# EAGLE design blip (EAGLE 9.6.2)
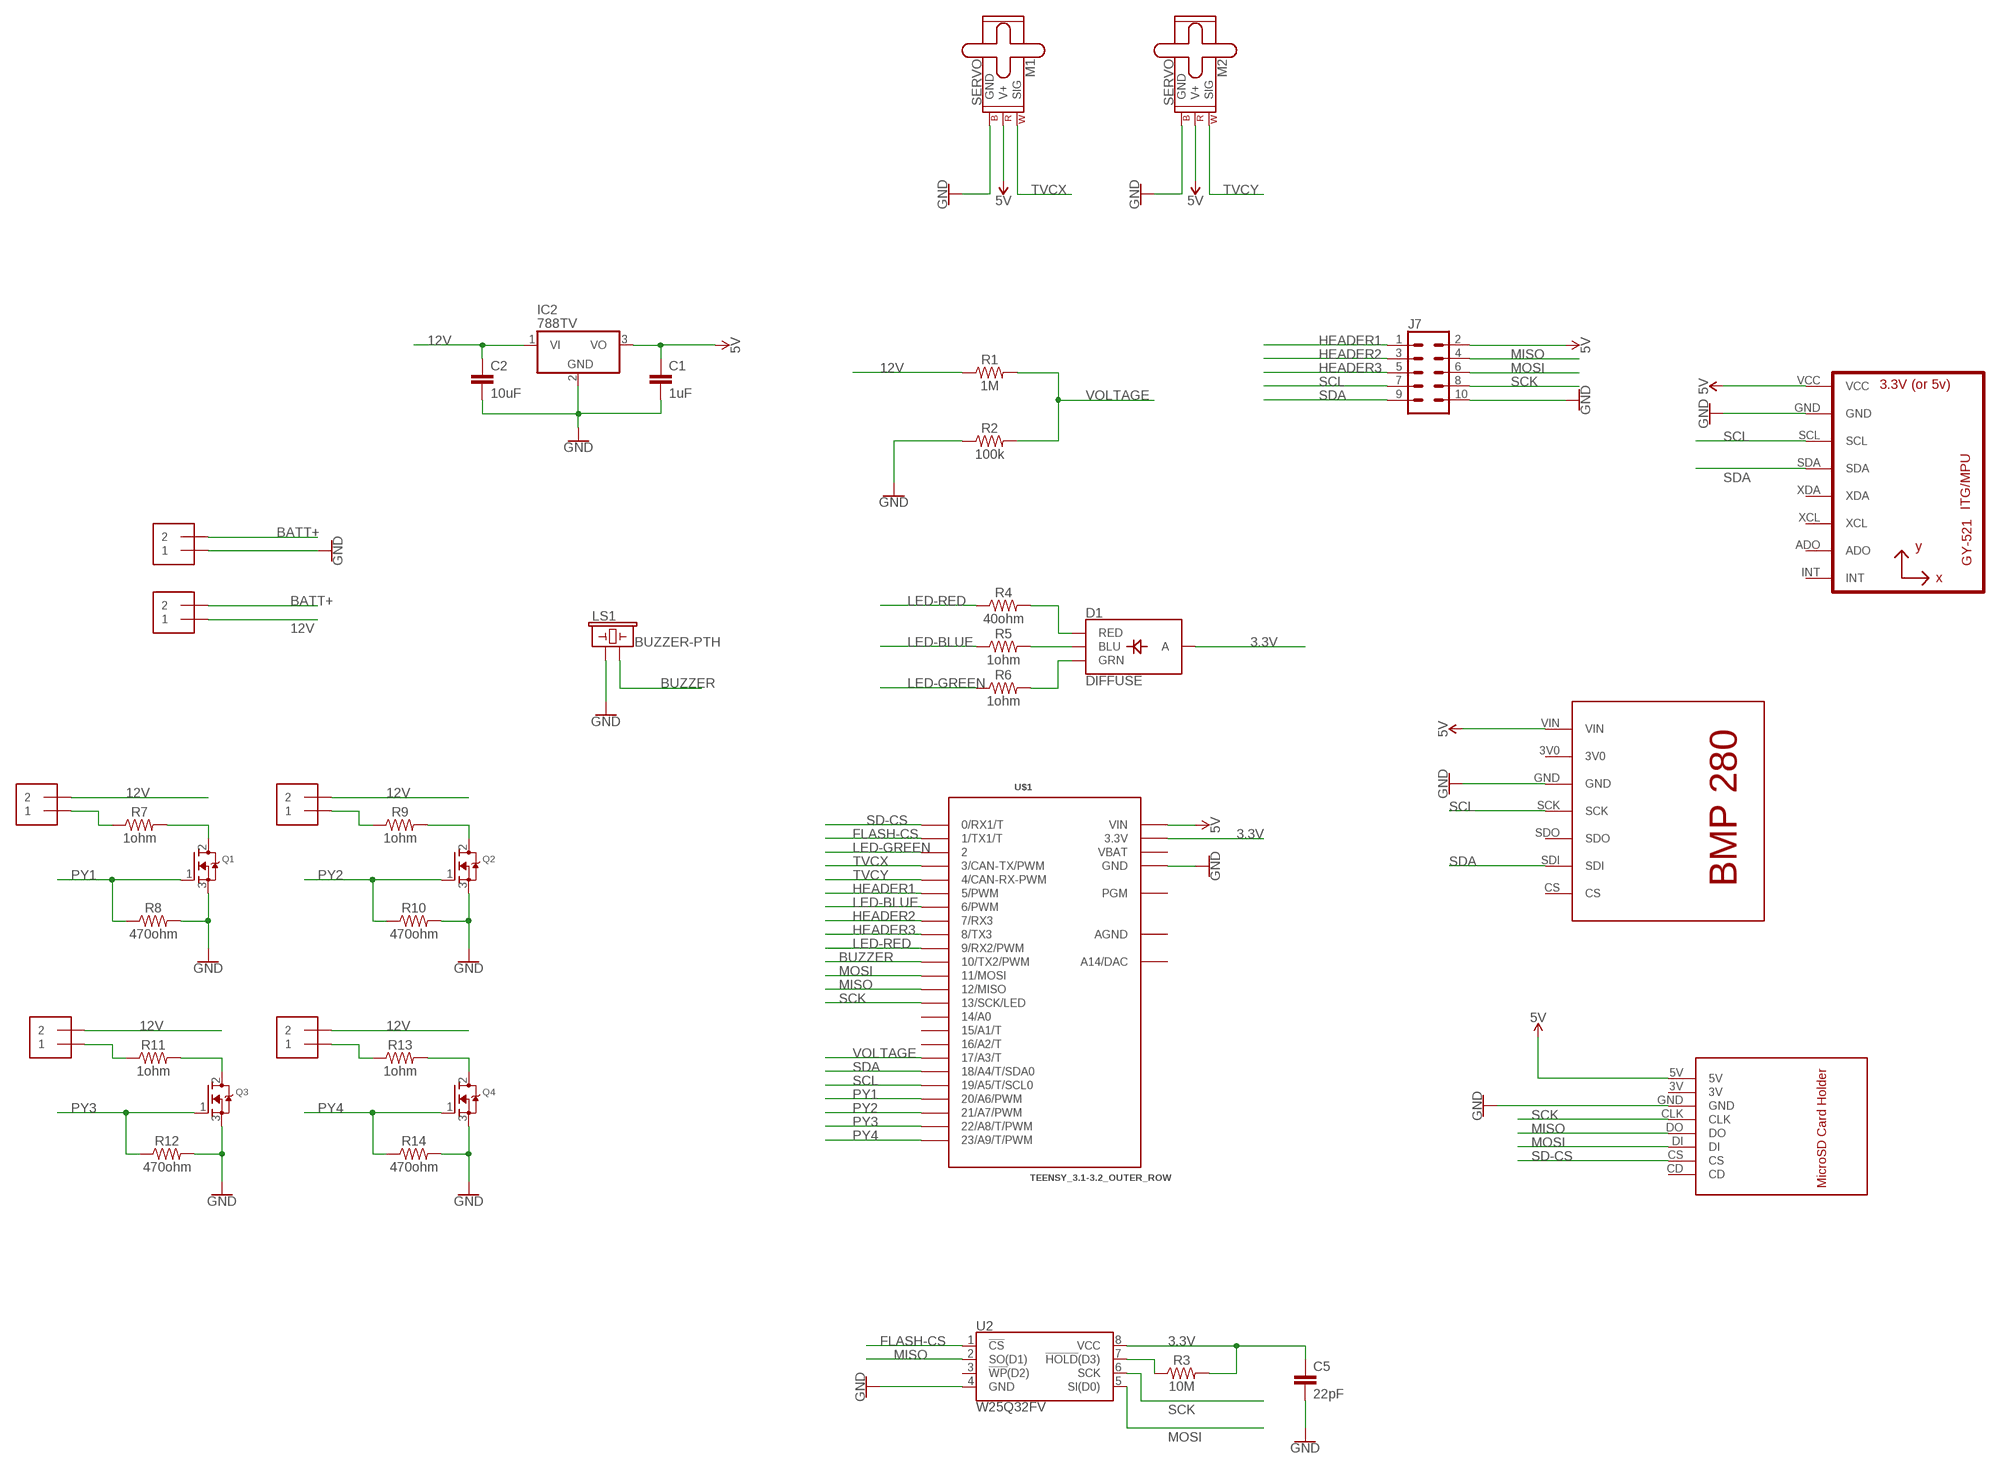
[diagram p0: schematic, sheet 1]

## Parts
C1  1uF  22PF-PTH-2.54MM-200V-5%  [CAP-PTH-2.54]
C2  10uF  22PF-PTH-2.54MM-200V-5%  [CAP-PTH-2.54]
C5  22pF  22PF-PTH-2.54MM-200V-5%  [CAP-PTH-2.54]
D1  DIFFUSE  LED-RGB-CADIFFUSE  [LED-RGB-THRU]
IC2  788TV  [TO220V]
J1  1X2-3.5MM  [1X2-3.5MM]
J2  1X2-3.5MM  [1X2-3.5MM]
J3  1X2-3.5MM  [1X2-3.5MM]
J4  1X2-3.5MM  [1X2-3.5MM]
J5  1X2-3.5MM  [1X2-3.5MM]
J6  1X2-3.5MM  [1X2-3.5MM]
J7  CONN_05X2NO_SILK  [2X5_NOSILK]
LS1  BUZZER-PTH  [BUZZER-12MM]
M1  SERVO  [1X03]
M2  SERVO  [1X03]
Q1  MOSFET-NGDS_TO220V  [TO220V]
Q2  MOSFET-NGDS_TO220V  [TO220V]
Q3  MOSFET-NGDS_TO220V  [TO220V]
Q4  MOSFET-NGDS_TO220V  [TO220V]
R1  1M  10MOHM-HORIZ-1/4W-5%  [AXIAL-0.3]
R2  100k  10MOHM-HORIZ-1/4W-5%  [AXIAL-0.3]
R3  10M  10MOHM-HORIZ-1/4W-5%  [AXIAL-0.3]
R4  40ohm  10MOHM-HORIZ-1/4W-5%  [AXIAL-0.3]
R5  1ohm  10MOHM-HORIZ-1/4W-5%  [AXIAL-0.3]
R6  1ohm  10MOHM-HORIZ-1/4W-5%  [AXIAL-0.3]
R7  1ohm  10MOHM-HORIZ-1/4W-5%  [AXIAL-0.3]
R8  470ohm  10MOHM-HORIZ-1/4W-5%  [AXIAL-0.3]
R9  1ohm  10MOHM-HORIZ-1/4W-5%  [AXIAL-0.3]
R10  470ohm  10MOHM-HORIZ-1/4W-5%  [AXIAL-0.3]
R11  1ohm  10MOHM-HORIZ-1/4W-5%  [AXIAL-0.3]
R12  470ohm  10MOHM-HORIZ-1/4W-5%  [AXIAL-0.3]
R13  1ohm  10MOHM-HORIZ-1/4W-5%  [AXIAL-0.3]
R14  470ohm  10MOHM-HORIZ-1/4W-5%  [AXIAL-0.3]
U1  GY-521MPU6050  [GY-521]
U2  W25Q32FV  W25Q32FVSS  [SOIC-8]
U$1  TEENSY_3.1-3.2_OUTER_ROW  [TEENSY_3.0-3.2&LC_OUTER_ROW]
U$2  BMP280  [BMP280]
U$3  SDCARD  [SDCARD]

## Nets
3.3V: C5.1 D1.2(A) R3.P$2 U2.8(VCC) U$1.3.3V U$1.3.3V1(3.3V)
5V: C1.1 IC2.3(VO) J7.2 M1.2(V+) M2.2(V+) U1.VCC U$1.VIN U$2.VIN U$3.5V
12V: C2.1 IC2.1(VI) J2.1 J3.2 J4.2 J5.2 J6.2 R1.P$1
BATT+: J1.2 J2.2
BUZZER: LS1.- U$1.10(10/TX2/PWM)
FLASH-CS: U2.1(!CS!) U$1.1(1/TX1/T)
GND: C1.2 C2.2 C5.2 IC2.2(GND) J1.1 J7.10 LS1.+ M1.3(GND) M2.3(GND) Q1.3(S) Q2.3(S) Q3.3(S) Q4.3(S) R2.P$1 R8.P$2 R10.P$2 R12.P$2 R14.P$2 U1.GND U2.4(GND) U$1.GND U$1.GND1(GND) U$2.GND U$3.GND
HEADER1: J7.1 U$1.5(5/PWM)
HEADER2: J7.3 U$1.7(7/RX3)
HEADER3: J7.5 U$1.8(8/TX3)
LED-BLUE: R5.P$1 U$1.6(6/PWM)
LED-GREEN: R6.P$1 U$1.2
LED-RED: R4.P$1 U$1.9(9/RX2/PWM)
MISO: J7.4 U2.2(SO(D1)) U$1.12(12/MISO) U$3.DO
MOSI: J7.6 U2.5(SI(D0)) U$1.11(11/MOSI) U$3.DI
N$1: R3.P$1 U2.7(!HOLD!(D3))
N$2: D1.4(BLU) R5.P$2
N$3: D1.3(GRN) R6.P$2
N$4: D1.1(RED) R4.P$2
N$5: J3.1 R7.P$1
N$6: Q1.2(D) R7.P$2
N$8: J4.1 R9.P$1
N$9: Q2.2(D) R9.P$2
N$11: J5.1 R11.P$1
N$12: Q3.2(D) R11.P$2
N$14: J6.1 R13.P$1
N$15: Q4.2(D) R13.P$2
PY1: Q1.1(G) R8.P$1 U$1.20/A6(20/A6/PWM)
PY2: Q2.1(G) R10.P$1 U$1.21/A7(21/A7/PWM)
PY3: Q3.1(G) R12.P$1 U$1.22/A8(22/A8/T/PWM)
PY4: Q4.1(G) R14.P$1 U$1.23/A9(23/A9/T/PWM)
SCK: J7.8 U2.6(SCK) U$1.13(13/SCK/LED) U$3.CLK
SCL: J7.7 U1.SCL U$1.19/A5(19/A5/T/SCL0) U$2.SCK
SD-CS: U$1.0(0/RX1/T) U$3.CS
SDA: J7.9 U1.SDA U$1.18/A4(18/A4/T/SDA0) U$2.SDI
TVCX: M1.1(SIG) U$1.3(3/CAN-TX/PWM)
TVCY: M2.1(SIG) U$1.4(4/CAN-RX-PWM)
VOLTAGE: R1.P$2 R2.P$2 U$1.17/A3(17/A3/T)
Unconnected: U1.ADO U1.INT U1.XCL U1.XDA U2.3(!WP!(D2)) U$1.14/A0 U$1.15/A1(15/A1/T) U$1.16/A2(16/A2/T) U$1.PGM U$1.RESET/DAC(A14/DAC) U$2.3V0 U$2.CS U$2.SDO U$3.3V U$3.CD

## Power pins joined to a net without a drawn wire
AGND: U$1.AGND
VBAT: U$1.VBAT

## Library data of the parts
C1 C2 = SparkFun-Capacitors:22PF: 22pF ceramic capacitors A capacitor is a passive two-terminal electrical component used to store electrical energy temporarily in an electric field.; PROD_ID: CAP-09128; VALUE: 22pF
C5 = SparkFun-Capacitors:22PF: 22pF ceramic capacitors A capacitor is a passive two-terminal electrical component used to store electrical energy temporarily in an electric field.; PROD_ID: CAP-09128
D1 = SparkFun-LED:LED-RGB-CA: LED-RGB Diffused Common Anode Packages: LED RGB-THRU P-LCC-4-3 LED-TRICOLOR-SMD SparkFun Products: RGB Diffused Common Anode- Diffuse <[https://www.sparkfun.com/products/10821]> RGB Diffused Common Anode - Clear <[https://www.sparkfun.com/products/10820]> Qduino Mini <[https://www.sparkfun.com/products/13614]> Triple Output LED RGB - SMD <https://www.sparkfun.com/products/7844>; PROD_ID: DIO-10632
IC2 = linear:78*: Positive VOLTAGE REGULATOR Source: http://cache.national.com/ds/LM/LM78L05.pdf http://www.fairchildsemi.com/ds/LM/LM7805.pdf
J1-J6 = adafruit:1X2: 3.5mm Terminal block http://www.ladyada.net/library/pcb/eaglelibrary.html
J7 = SparkFun-Connectors:CONN_05X2: Multi connection point. Often used as Generic Header-pin footprint for 0.1 inch spaced/style header connections For AVR SPI programming port, see special device with nice symbol: "AVR_SPI_PROG_5x2.dev" You can populate with any combo of single row headers, but if you'd like an exact match, check these: 2x5 AVR ICSP Male Header <https://www.sparkfun.com/products/778> (PRT-00778) 2x5 Pin Shrouded Header <https://www.sparkfun.com/products/8506> (PRT-08506) On any of the 0.1 inch spaced packages, you can populate with these: Break Away Headers - Straight <https://www.sparkfun.com/products/116> (PRT-00116) Break Away Male Headers - Right Angle <https://www.sparkfun.com/products/553> (PRT-00553) Female Headers <https://www.sparkfun.com/products/115> (PRT-00115) Break Away Headers - Machine Pin <https://www.sparkfun.com/products/117> (PRT-00117) Break Away Female Headers - Swiss Machine Pin <https://www.sparkfun.com/products/743> (PRT-00743) Special note: the shrouded connector mates well with our 5x2 ribbon cables: 2x5 Pin IDC Ribbon Cable <https://www.sparkfun.com/products/8535> (PRT-08535)
LS1 = SparkFun-Electromechanical:BUZZER: Buzzer Small round buzzers that operate around the audible 2kHz range. You can use these as speakers to create simple music or user interfaces. Variant Overview: PTH - Mini Speaker - PC Mount 12mm 2.048kHz <https://www.sparkfun.com/products/7950> PTH_KIT - Mini Speaker - PC Mount 12mm 2.048kHz <https://www.sparkfun.com/products/7950> KIT simplifies soldering by adding stop mask to one side of the pads. PTH_NO_SILK - Mini Speaker - PC Mount 12mm 2.048kHz <https://www.sparkfun.com/products/7950> No silkscreen indicator of buzzer outline. PTH_KIT_NO_SILK - Mini Speaker - PC Mount 12mm 2.048kHz <https://www.sparkfun.com/products/7950> KIT package w/o silkscreen SMD - Buzzer Audio Magnetic (CCV-084B16) SMD buzzer used on, e.g. the LilyPad Buzzer <https://www.sparkfun.com/products/8463> and RFID USB Reader <https://www.sparkfun.com/products/9963>. SMD_KIT - Buzzer Audio Magnetic (CCV-084B16) SMD Buzzer with elongated pins to make soldering easier. Used on the SparkFun Simon Says - Surface Mount Soldering Kit <https://www.sparkfun.com/products/10935>. SMD-SQUARE - Buzzer Audio Magnetic (COMP-15701) SMT square buzzer with one chamfered corner.; PROD_ID: COMP-08253; SF_SKU: COM-07950
M1 M2 = SparkFun-Electromechanical:SERVO: Servo Motor 3-pin connector for a standard servo motor (voltage supply, ground, and control signal.) SparkFun Products Servo - Generic (Sub-Micro Size) <https://www.sparkfun.com/products/9065> (ROB-09065) Servo - Generic High Torque Continuous Rotation (Standard Size) <https://www.sparkfun.com/products/9347> (ROB-09347) Servo - Generic High Torque (Standard Size) <https://www.sparkfun.com/products/11965> (ROB-11965)
Q1-Q4 = adafruit:MOSFET-N: N-Channel Mosfet 2N7002E - 60V 260mA SOT23 [Digikey: 2N7002ET1GOSTR-ND] - REEL BSH103 - 30V 850mA SOT23 [Digikey: 568-5013-1-ND]
R1 R2 R4-R14 = SparkFun-Resistors:10MOHM: RES-09327; PROD_ID: RES-09327; VALUE: 10M
R3 = SparkFun-Resistors:10MOHM: RES-09327; PROD_ID: RES-09327
U1 = gy-521:GY-521
U2 = SparkFun-IC-Memory:W25Q32FV: W25Q32FV 32Mb (4MB) Serial Flash Memory The W25Q32FV support the standard Serial Peripheral Interface (SPI), Dual/Quad I/O SPI as well as 2-clocks instruction cycle Quad Peripheral Interface (QPI). 104MHz, SPI, 8-SOIC-EIAJ Datasheet <http://www.winbond.com/resource-files/w25q32fv%20revh%20091613.pdf> SparkFun Products SparkFun Blynk Board - ESP8266 <https://www.sparkfun.com/products/13794> (WRL-13794); PROD_ID: IC-13229
U$1 = Teensy_3_and_LC_Series_Boards_v1.4:TEENSY_3.1-3.2_OUTER_ROW: Footprint for Teensy 3.1 or 3.2 board using all pin connections on the outer perimeter
U$2 = BMP280:BMP280
U$3 = MicroSD-card breakout board:SDCARD

## Board
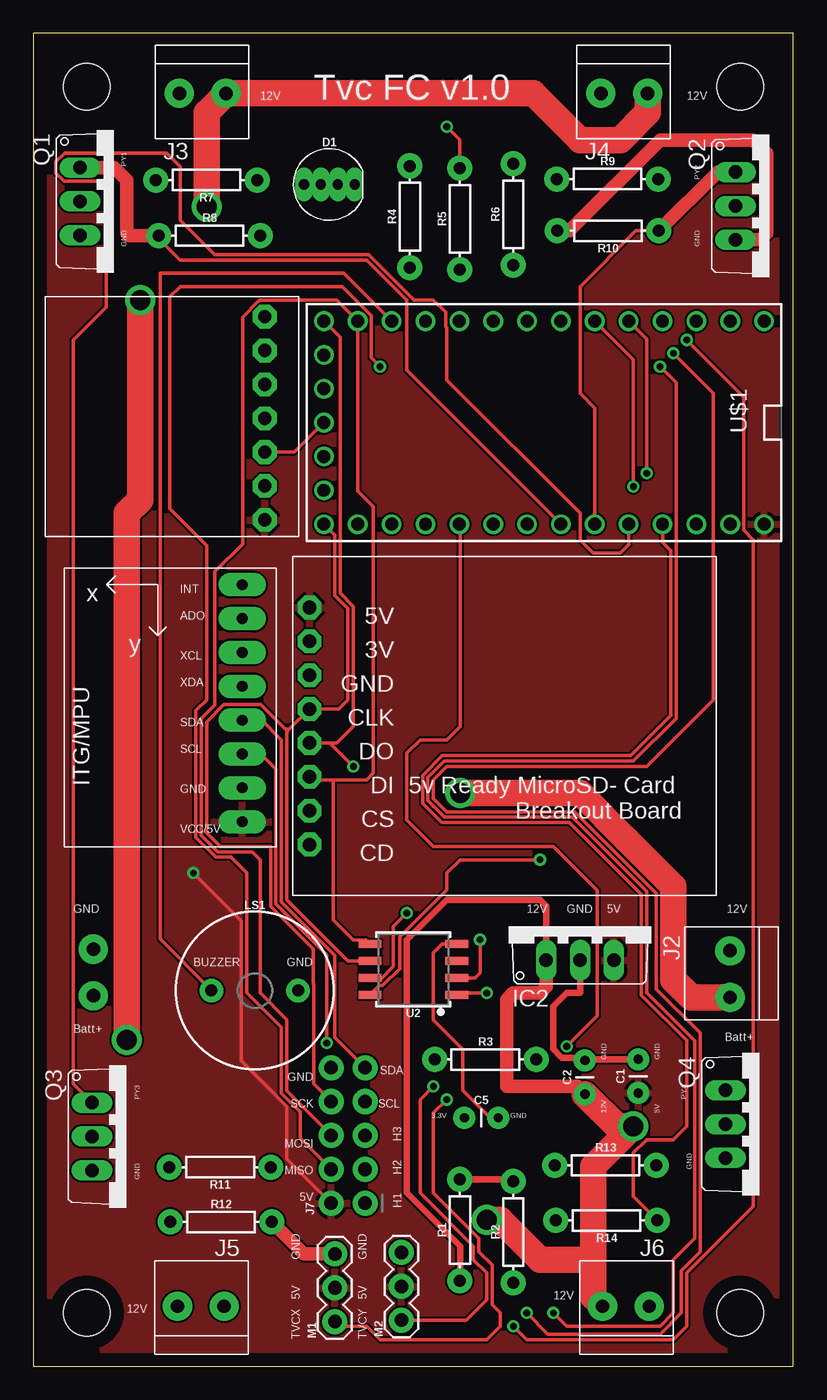
[diagram p1: board, top side]
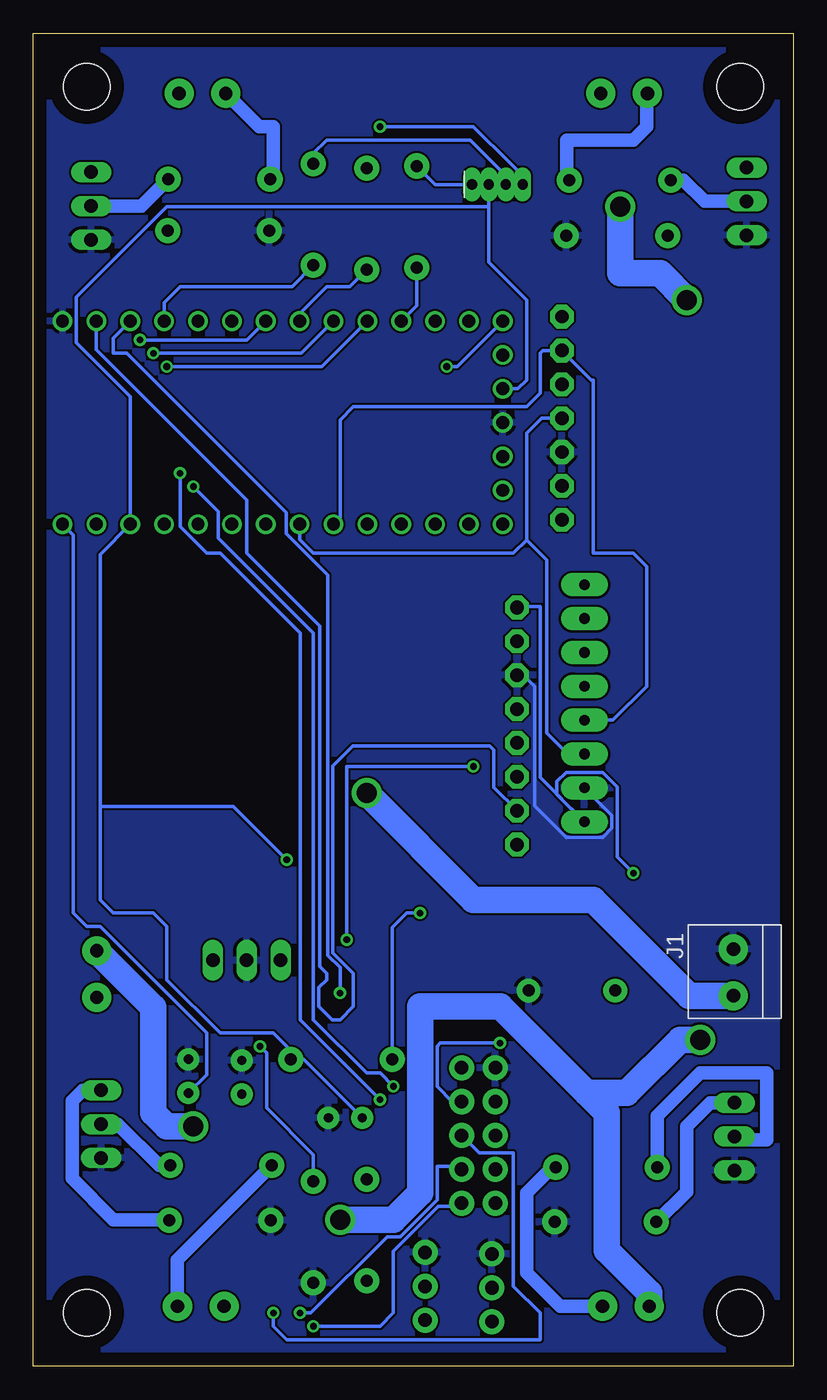
[diagram p2: board, bottom side, seen from below]

Size 57 x 100 mm. Coordinates in mm from the lower left corner, seen from the top.
Outline: 0,0 57,0 57,100 0,100 0,0
Copper layers (1*16): Top 0.035mm / dielectric 1.5mm / Bottom 0.035mm
Design rules "default": minimum track width 6mil, minimum drill 0.35mm, track to track 6mil, track to pad 6mil, pad to pad 6mil, via to via 6mil, smd to smd 6mil, copper to edge 40mil, drill to drill 6mil, minimum pad ring 10mil, minimum via ring 8mil, stop-mask expansion 4mil, vias tented up to drill 0mil, thermal gap 10mil
Holes 3.5 mm at 4,96 53,96 53,4 4,4

### Footprints (pad centres in the part's own frame; a part is rotated, then mirrored left to right if it is on the bottom)
CAP-PTH-2.54 = drill 0.7 pad 1.651: 1 -1.27,0; 2 1.27,0
LED-RGB-THRU = drill 0.762 pad 0.889 long: 1 1.905,0; 2 0.635,0; 3 -0.635,0; 4 -1.905,0
TO220V = drill 1.016 long: 1 -2.54,-2.54; 2 0,-2.54; 3 2.54,-2.54
1X2-3.5MM = drill 1 pad 2.184: 1 1.8,0; 2 -1.7,0
2X5_NOSILK = drill 1.016 pad 1.88: 1 0,0; 2 0,2.54; 3 2.54,0; 4 2.54,2.54; 5 5.08,0; 6 5.08,2.54; 7 7.62,0; 8 7.62,2.54; 9 10.16,0; 10 10.16,2.54
BUZZER-12MM = drill 0.9 pad 1.778: + 3.25,0; - -3.25,0
1X03 = drill 1.016 pad 1.88: 1 0,0; 2 2.54,0; 3 5.08,0
AXIAL-0.3 = drill 0.9 pad 1.88: P$1 -3.81,0; P$2 3.81,0
GY-521 = drill 0.8 pad 1.778 long: ADO -8.89,-6.35; GND -8.89,6.35; INT -8.89,-8.89; SCL -8.89,3.81; SDA -8.89,1.27; VCC -8.89,8.89; XCL -8.89,-3.81; XDA -8.89,-1.27
SOIC-8 = smd 0.61 x 1.702: 1 -1.905,-3.251; 2 -0.635,-3.251; 3 0.635,-3.251; 4 1.905,-3.251; 5 1.905,3.251; 6 0.635,3.251; 7 -0.635,3.251; 8 -1.905,3.251
TEENSY_3.0-3.2&LC_OUTER_ROW = drill 0.965: 0 -7.62,13.97; 1 -7.62,11.43; 2 -7.62,8.89; 3 -7.62,6.35; 3.3V 7.62,11.43; 3.3V1 -2.54,-16.51; 4 -7.62,3.81; 5 -7.62,1.27; 6 -7.62,-1.27; 7 -7.62,-3.81; 8 -7.62,-6.35; 9 -7.62,-8.89; 10 -7.62,-11.43; 11 -7.62,-13.97; 12 -7.62,-16.51; 13 7.62,-16.51; 14/A0 7.62,-13.97; 15/A1 7.62,-11.43; 16/A2 7.62,-8.89; 17/A3 7.62,-6.35; 18/A4 7.62,-3.81; 19/A5 7.62,-1.27; 20/A6 7.62,1.27; 21/A7 7.62,3.81; 22/A8 7.62,6.35; 23/A9 7.62,8.89; AGND 7.62,13.97; GND -7.62,16.51; GND1 0,-16.51; PGM 2.54,-16.51; RESET/DAC 5.08,-16.51; VBAT -5.08,-16.51; VIN 7.62,16.51
BMP280 = drill 1 pad 1.778 octagon: 3V0 3.81,2.54; CS 16.51,2.54; GND 6.35,2.54; SCK 8.89,2.54; SDI 13.97,2.54; SDO 11.43,2.54; VIN 1.27,2.54
SDCARD = drill 1.016 pad 1.778 octagon: 3V 30.48,6.35; 5V 30.48,3.81; CD 30.48,21.59; CLK 30.48,11.43; CS 30.48,19.05; DI 30.48,16.51; DO 30.48,13.97; GND 30.48,8.89

### Placement (x,y rotation side)
C1  45.37,21.76 90 top
C2  41.37,21.68 90 top
C5  33.6,18.63 0 top
D1  22.2,88.66 0 top
IC2  41,33 0 top
J1  4.5,29.49 90 bottom
J2  52.25,29.37 90 top
J3  12.75,95.5 180 top
J4  44.37,95.5 180 top
J5  12.51,4.5 0 top
J6  44.39,4.5 0 top
J7  24.88,12.23 90 top
LS1  16.61,28.18 0 top
M1  22.61,3.34 90 top
M2  27.61,3.45 90 top
Q1  6.04,87.39 270 top
Q2  55.2,87.05 270 top
Q3  6.95,17.23 270 top
Q4  54.45,18.16 270 top
R1  31.99,10.22 90 top
R2  35.99,10.06 90 top
R3  33.9,23.01 0 top
R4  28.24,86.24 90 top
R5  31.99,86.08 90 top
R6  35.99,86.42 90 top
R7  12.99,88.99 180 top
R8  13.22,84.82 0 top
R9  43.06,89.07 0 top
R10  43.1,85.18 180 top
R11  14.01,14.93 180 top
R12  14.08,10.82 0 top
R13  42.92,15.07 0 top
R14  42.99,10.93 180 top
U1  6.78,49.74 180 top
U2  28.5,29.77 90 top
U$1  38.3,70.79 270 top
U$2  19.9,62.23 90 top
U$3  51.2,60.73 180 top

### Tracks (layer width: path | path; a pad name or v marks a point on that pad's centre or on a via)
3.3V  (via drill 0.5)
  Top 0.25: U2.8 25.94,28.55 26.21,28.55 27.47,29.81 27.47,32.22 31,35.75 31,37 32,38 v38,38
  Bottom 0.25: D1.2 22.84,87 | 22.84,87 22.84,82.83 20,80 20,74 20.67,73.33 U$1.3.3V1 | 22.84,87 47,87 53.8,80.2 53.8,76.8 49.73,72.73 U$1.3.3V 52,60.9 52,42 | C5.1 36.71,23.01 R3.P$2 37.71,23.71 39,25 43,25 47,29 47,33 48,34 51,34 52,35 52,42 | v38,38 42,42 52,42
5V  (via drill 0.5)
  Top 0.25: J7.2 19,15.57 19,19.51 15.6,22.91 15.6,33.4 v12,37
  Bottom 0.25: U$3.5V 20.64,57 19,57 19,44.18 U1.VCC 17.73,42.91 17.73,43.87 17.04,44.56 14.3,44.56 13.21,43.47 13.21,38.21 v12,37 | C1.1 44,21.86 44,25 52,33 53,33 54,34 54,62.36 U$1.VIN
  pour Top: -3,103 63,103 63,-6 -6,-6 -6,103
12V  (via drill 1.5)
  Top 0.5: IC2.1 38.46,34.54 38,35 31,35 28,32 28,13 32,9 R1.P$1
  Top 1: C2.1 40.78,21 35.5,21 35.5,27 35.5,27.5 36,28 38,28 38.46,28.46 IC2.1
  Top 2: C2.1 43.78,18 v45,18 42,15 42,8 | J6.2 42,5.19 42,8 | 42,8 38,8 35,11 v34,11 | J4.2 46.07,94.07 44,92 41,92 37.5,95.5 J3.2 13,94.05 v13,87 | v7,24.5 7,64 8,65 v8,80
  Bottom 2: J2.1 48,26.92 48,19 47,18 v45,18 | v34,11 30,11 28,13 28,22.14 28,23.88 28,27 22,27 15.5,20.5 | 15.5,20.5 14,19 14,8.69 10.81,5.5 J5.2 | 15.5,20.5 12.5,20.5 8.5,24.5 v7,24.5 | v8,80 10,82 13,82 v13,87
BATT+  (via drill 1.5)
  Top 2: v32,43 41,43 44.5,39.5 48,36 48,31 48,29 49.33,27.67 J2.2
  Bottom 2: J1.2 7.79,27.79 15,35 24,35 v32,43
BUZZER
  Top 0.25: U$1.10 23.28,82 9.5,82 9.5,32.04 LS1.-
FLASH-CS  (via drill 0.5)
  Top 0.25: U2.1 31.89,28 v34,28
  Bottom 0.25: U$1.1 51,77.14 51,76 50,76 38.04,64.04 38.04,62.48 34.93,59.36 34.93,30.83 34,29.9 v34,28
GND
  Top 0.25: C5.2 34.27,18.63 32.22,20.68 32.22,23.78 30,26 30,31 30.68,31.68 U2.4 | U$2.GND 19.58,68.58 U$1.GND1
  Top 0.5: IC2.2 41,28 40,28 39,27 39,23.79 39.65,23.14 41.18,23.14 C2.2 41.45,23.03 C1.2
  Top 1: R12.P$2 20.29,8.42 M1.3 | R10.P$2 40.18,85.18 47,92 54,92 55,91 55,85 54.51,84.51 Q2.3
  Bottom 0.25: U1.GND 13.62,41.33 13.62,40.37 14.3,39.68 17.04,39.68 19.4,42.04 19.4,51 20.24,51.84 U$3.GND
  pour Bottom: -4,103 63,103 63,-5 -4,-5
HEADER1  (via drill 0.5)
  Top 0.25: v36,3 37,2 48,2 49,3 49,7 54,12 54,62 53.28,62.72 53.28,72.72 v49,77
  Bottom 0.25: J7.1 25.11,12 26.62,12 30,8.62 30,4 31,3 v36,3 | v49,77 40.98,77 U$1.5
HEADER2  (via drill 0.5)
  Top 0.25: v37,4 38.6,2.4 47,2.4 48.6,4 48.6,7.17 50,8.57 50,25 46.72,28.28 46.72,35.47 40.6,41.6 31,41.6 30,42.6 30,44 31,45 46,45 51,50 51,73 v48,76
  Bottom 0.25: J7.3 25.11,15 26.72,15 26.72,12.47 29.47,9.72 30.47,9.72 36.19,4 v37,4 | v48,76 36.9,76 U$1.7
HEADER3  (via drill 0.5)
  Top 0.25: v39,4 40,3 47,3 48,4 48,8 49.6,9.6 49.6,24.4 46,28 46,35.62 40.43,41.19 30.83,41.19 30.03,42 30,42 30,42.03 29.6,42.43 29.6,44.17 30.83,45.4 45,45.4 48.2,48.61 48.2,73.8 v47,75
  Bottom 0.25: J7.5 23.57,16 21,16 21,6 19,4 19,2 38,2 39,3 v39,4 | v47,75 35.36,75 U$1.8
LED-BLUE
  Bottom 0.25: R5.P$1 33.26,81 35,81 37.03,78.97 U$1.6
LED-GREEN
  Bottom 0.25: R6.P$1 37.6,81 46,81 47.19,79.81 U$1.2
LED-RED
  Bottom 0.25: R4.P$1 28.24,79.58 U$1.9
MISO  (via drill 0.5)
  Top 0.25: U$1.12 23,77.2 23,58 24,57 24,48 22.76,46.76 22.24,46.76 | 22.24,46.76 U$3.DO | U2.2 33.13,29.14 33.5,29.5 v33.5,32 | v24,45 22.24,46.76 | J7.4 20,17.11 20,19.08 18.6,20.48 18.6,25.4 16,28 16,37 14.8,38.2 13.67,38.2 12.2,39.67 12.2,49.2 13,50 13,61.57 10.23,64.34 10.23,80.23 11,81 23.17,81 25.34,78.83 25.34,75.66 v26,75
  Bottom 0.25: v33.5,32 33.5,45 v24,45 | v26,75 25.2,75 U$1.12
MOSI
  Top 0.25: U2.5 24.92,32 24,32 22.5,33.5 22.5,44 | J7.6 19,20.65 19,26 17,28 17,38 16.4,38.6 13.83,38.6 12.6,39.83 12.6,48.6 13.62,49.62 13.62,59.62 15.69,61.69 15.69,78.72 16.88,79.91 16.91,79.91 17,80 22.74,80 U$1.11 24.33,65.67 25.5,64.5 25.5,44.5 25,44 22.5,44 | 22.5,44 20.94,44 U$3.DI
N$1  (via drill 0.5)
  Top 0.25: U2.7 25.11,29 26,29 27,30 27,33 v28,34
  Bottom 0.25: v28,34 29,34 30.09,32.91 R3.P$1
N$2  (via drill 0.5)
  Top 0.25: v31,93 31.99,92.01 R5.P$2
  Bottom 0.25: D1.4 20.3,89.31 21.19,90.21 21.21,90.21 24,93 v31,93
N$3
  Bottom 0.25: D1.3 21.92,89.02 21.92,89.67 24.25,92 35,92 35.99,91.01 R6.P$2
N$4
  Bottom 0.25: D1.1 26.85,88.66 R4.P$2
N$5
  Bottom 1: J3.1 11,95.45 11,93 12,92 17,92 17,89.19 R7.P$1
N$6
  Bottom 1: R7.P$2 8.24,88.99 6.64,87.39 Q1.2
N$8
  Bottom 1: J4.1 40.07,93 39,93 39,89.32 R9.P$1
N$9
  Bottom 1: R9.P$2 48.89,87.05 Q2.2
N$11
  Bottom 1: R11.P$1 18.07,14.93 20,13 20,7 17.5,4.5 J5.1
N$12
  Bottom 1: R11.P$2 10.2,18.8 7,22 2,22 2,17 4.18,17 Q3.2
N$14
  Bottom 1: J6.1 46.19,7.99 R13.P$1
N$15
  Bottom 1: R13.P$2 47.57,15.07 50.66,18.16 Q4.2
PY1
  Top 0.25: U$1.20/A6 28,74.74 28,80 25,83 11,83 9.41,84.59 R8.P$1
  Top 1: R8.P$1 7.18,84.82 7,85 7,89 6.07,89.93 Q1.1
PY2
  Top 0.25: U$1.21/A7 42.11,71.89 41,73 41,81 45.18,85.18 R10.P$1
  Top 1: R10.P$1 51.32,89.59 Q2.1
PY3
  Top 0.25: U$1.22/A8 44.65,61.65 44,61 42,61 41,62 41,64 31,74 31,77.93 30.94,77.99 30.94,79.06 30,80 28.57,80 25.17,83.4 13.6,83.4 11,86 11,90 10,91 2.34,91 1.7,90.36 1.7,89.5 2.31,88.89 5.11,88.89 5.47,88.53 5.47,79.47 3,77 3,21.18 Q3.1
  Bottom 1: R12.P$1 8,13.09 8,18 6.23,19.77 Q3.1
PY4
  Top 0.25: U$1.23/A9 47.19,61.81 47.8,61.2 47.8,48.8 44.8,45.8 30.67,45.8 29.2,44.33 29.2,42.24 30.64,40.79 40.21,40.79 45.6,35.4 45.6,27.83 49,24.43 49,18 48,17 46,17 45,16 45,12.73 R14.P$1
  Bottom 1: R14.P$1 46.87,11 51,11 54.09,14.09 54.09,19.91 53.3,20.7 Q4.1
SCK
  Top 0.25: U$1.13 22.6,62.36 22.6,57.83 23.6,56.83 23.6,50 22.9,49.3 U$3.CLK 19.21,47.79 | 19.21,47.79 19,47.58 19,35 23.59,30.41 24,30.41 U2.6 | J7.8 21.03,21.16 21.03,28.66 21,28.69 21,31.29 17.79,34.5 17.79,39 14,39 13,40 13,48.34 14.3,49.64 17.04,49.64 18.89,47.79 19.21,47.79
SCL  (via drill 0.5)
  Top 0.25: U1.SCL 17.07,45.93 18.2,44.8 18.2,34.67 22,30.86 v22,24.25
  Bottom 0.25: U$1.19/A5 37.03,62.03 36,61 21,61 20,62 | 20,62 20,70 18.88,71.12 U$2.SCK | 20,62 18.5,60.5 18.5,47.5 16.93,45.93 U1.SCL | v22,24.25 26.47,24.25 26.72,24 26.72,21.61 26.72,21 25.57,19.85 J7.7
SD-CS
  Bottom 0.25: U$3.CS 22.47,43.43 22.47,46.22 22.78,46.53 33.04,46.53 34.53,45.04 34.53,31 33,29.47 33,27 34,26 34.6,26 35.6,27 35.6,28.4 35,29 35,29.47 35.53,30 35.53,55.53 41,61 41,65 52.27,76.27 U$1.0
SDA
  Top 0.25: U1.SDA 17.13,48.47 18.6,47 18.6,34.83 22.6,30.83 22.6,24.67 J7.9
  Bottom 0.25: U$1.18/A4 34,63.66 34,71 33,72 20,72 19,73 19,76 18.8,76.2 U$2.SDI 15.16,74 15,74 15,61 14,61 12,61 11,60 11,51 13.53,48.47 U1.SDA
TVCX  (via drill 0.5)
  Top 0.25: M1.1 22.95,3 25,3 26,2 34,2 35,3 35,4 34.4,4.6 34.4,7.6 33.4,8.6 33.4,9.6 30,13 30,19 v31,20 | U$1.3 46,77.06 v46,67
  Bottom 0.25: v31,20 37,26 37,55 43,61 44,61 46,63 v46,67
TVCY  (via drill 0.5)
  Top 0.25: M2.1 32.45,3.45 34,5 34,7 33,8 33,9 29,13 29,20 v30,21 | U$1.4 45,75.52 v45,66
  Bottom 0.25: v30,21 31,22 32,22 36,26 36,55 43.12,62.12 43.12,64.12 v45,66
VOLTAGE  (via drill 0.5)
  Top 0.25: U$1.17/A3 32,63.12 32,48 31,47 29,47 28,46 28,41 30,39 39,39 42.29,35.71 42.29,26.29 v40,24
  Top 0.5: R1.P$2 35.83,14.03 R2.P$2
  Bottom 0.25: v40,24 39.5,23.5 39.5,19.38 35.99,15.87 R2.P$2

### Text on the board
tNames: 12V | Tvc FC v1.0 | 12V | PY1 | PY2 | GND | GND | INT | ADO | XCL | XDA | SDA | SCL | GND | VCC/5V | GND | 12V | GND | 5V | 12V | BUZZER | GND | Batt+ | Batt+ | GND | GND | GND | SDA | PY3 | SCK | SCL | PY4 | 3.3V | GND | 12V | 5V | H3 | MOSI | H2 | GND | MISO | GND | 5V | H1 | GND | GND | 5V | 5V | 12V | 12V | TVCX | TVCY